# Altium schematic sheet GD_Power_Meter_3.SchDoc: Meter_2
size A3
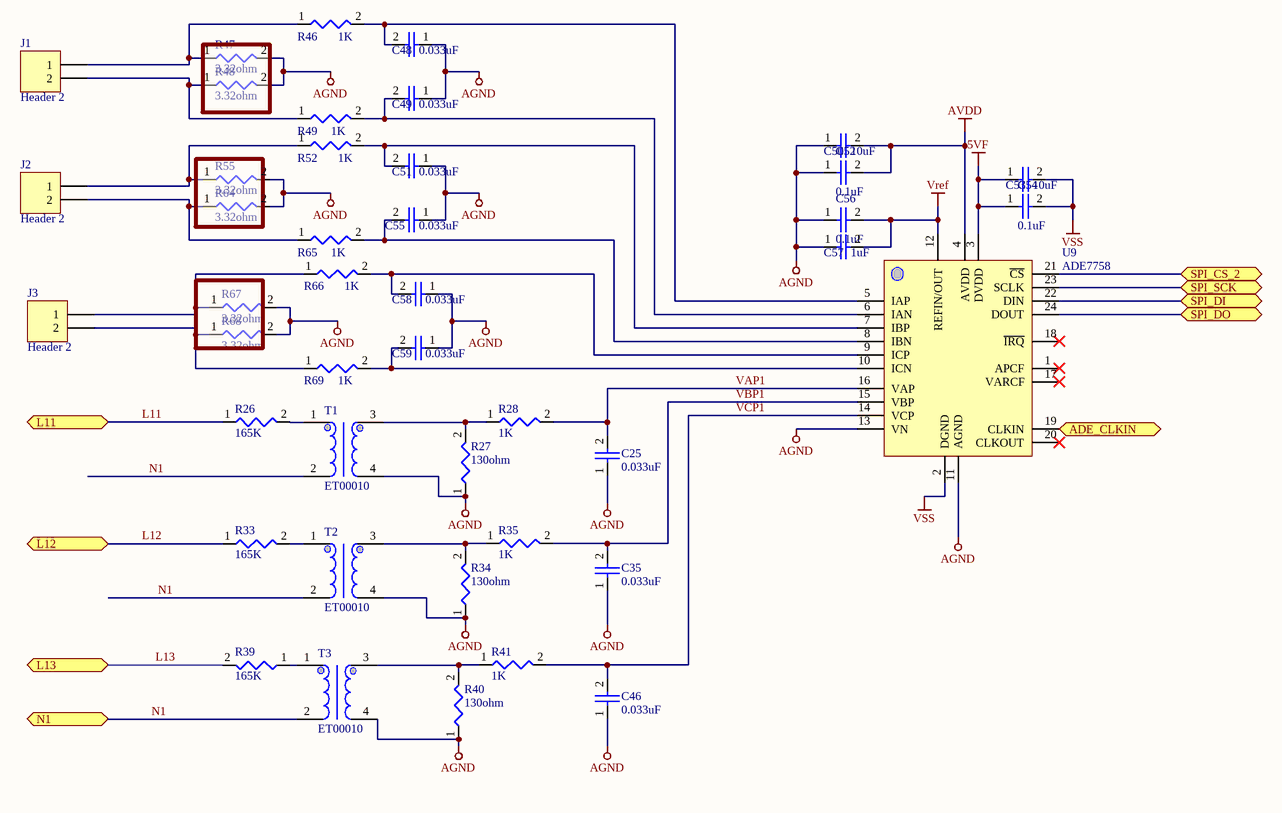
[diagram p0: GD_Power_Meter_3.SchDoc]

## Parts
C25  value 0.033uF  [C0805]  (hidden comment: CAP)
C35  value 0.033uF  [C0805]  (hidden comment: CAP)
C46  value 0.033uF  [C0805]  (hidden comment: CAP)
C48  value 0.033uF  [C0805]  (hidden comment: CAP)
C49  value 0.033uF  [C0805]  (hidden comment: CAP)
C50  10uF  [C0805]
C51  value 0.033uF  [C0805]  (hidden comment: CAP)
C52  value 0.1uF  [C0805]  (hidden comment: CAP)
C53  10uF  [C0805]
C54  value 0.1uF  [C0805]  (hidden comment: CAP)
C55  value 0.033uF  [C0805]  (hidden comment: CAP)
C56  value 0.1uF  [C0805]  (hidden comment: CAP)
C57  value 1uF  [C0805]  (hidden comment: CAP)
C58  value 0.033uF  [C0805]  (hidden comment: CAP)
C59  value 0.033uF  [C0805]  (hidden comment: CAP)
J1  Header 2  [533980271_sd]
J2  Header 2  [533980271_sd]
J3  Header 2  [533980271_sd]
R26  value 165K  [MFR5W2P5]  (hidden comment: RES)
R27  value 130ohm  [R0805]  (hidden comment: RES)
R28  value 1K  [R0805]  (hidden comment: RES)
R33  value 165K  [MFR5W2P5]  (hidden comment: RES)
R34  value 130ohm  [R0805]  (hidden comment: RES)
R35  value 1K  [R0805]  (hidden comment: RES)
R39  value 165K  [MFR5W2P5]  (hidden comment: RES)
R40  value 130ohm  [R0805]  (hidden comment: RES)
R41  value 1K  [R0805]  (hidden comment: RES)
R46  value 1K  [R0805]  (hidden comment: RES)
R47  value 3.32ohm  [R0805]  (hidden comment: RES)
R48  value 3.32ohm  [R0805]  (hidden comment: RES)
R49  value 1K  [R0805]  (hidden comment: RES)
R52  value 1K  [R0805]  (hidden comment: RES)
R55  value 3.32ohm  [R0805]  (hidden comment: RES)
R64  value 3.32ohm  [R0805]  (hidden comment: RES)
R65  value 1K  [R0805]  (hidden comment: RES)
R66  value 1K  [R0805]  (hidden comment: RES)
R67  value 3.32ohm  [R0805]  (hidden comment: RES)
R68  value 3.32ohm  [R0805]  (hidden comment: RES)
R69  value 1K  [R0805]  (hidden comment: RES)
T1  ET00010  [ZMPT107]
T2  ET00010  [ZMPT107]
T3  ET00010  [ZMPT107]
U9  ADE7758  [SOIC24-W]

## Ports
ADE_CLKIN (bidir), L11, L12, L13, N1, SPI_CS_2, SPI_DI, SPI_DO (bidir), SPI_SCK

## Nets
5VF: C53.1 C54.1 U9.3(DVDD)
AGND: C25.1 C35.1 C46.1 C48.1 C49.1 C50.1 C51.1 C52.1 C55.1 C56.1 C57.1 C58.1 C59.1 R27.1 R34.1 R40.1 R47.2 R48.2 R55.2 R64.2 R67.2 R68.2 T1.4 T2.4 T3.4 U9.11(AGND) U9.13(VN)
AVDD: C50.2 C52.2 U9.4(AVDD)
Vref: C56.2 C57.2 U9.12(REFIN/OUT)
VSS: C53.2 C54.2 U9.2(DGND)
ADE_CLKIN: U9.19(CLKIN) ; port ADE_CLKIN
L11: R26.1 ; port L11
L12: R33.1 ; port L12
L13: R39.2 ; port L13
N1: T1.2 T2.2 T3.2 ; port N1
SPI_CS_2: U9.21(~{CS}) ; port SPI_CS_2
SPI_DI: U9.22(DIN) ; port SPI_DI
SPI_DO: U9.24(DOUT) ; port SPI_DO
SPI_SCK: U9.23(SCLK) ; port SPI_SCK
VAP1: C25.2 R28.2 U9.16(VAP)
VBP1: C35.2 R35.2 U9.15(VBP)
VCP1: C46.2 R41.2 U9.14(VCP)
NetC48_2: C48.2 R46.2 U9.5(IAP)
NetC49_2: C49.2 R49.2 U9.6(IAN)
NetC51_2: C51.2 R52.2 U9.7(IBP)
NetC55_2: C55.2 R65.2 U9.8(IBN)
NetC58_2: C58.2 R66.2 U9.9(ICP)
NetC59_2: C59.2 R69.2 U9.10(ICN)
NetJ1_1: J1.1 R46.1 R47.1
NetJ1_2: J1.2 R48.1 R49.1
NetJ2_1: J2.1 R52.1 R55.1
NetJ2_2: J2.2 R64.1 R65.1
NetJ3_1: J3.1 R66.1 R67.1
NetJ3_2: J3.2 R68.1 R69.1
NetR26_2: R26.2 T1.1
NetR27_2: R27.2 R28.1 T1.3
NetR33_2: R33.2 T2.1
NetR34_2: R34.2 R35.1 T2.3
NetR39_1: R39.1 T3.1
NetR40_2: R40.2 R41.1 T3.3

Not connected (* = marked no-connect by the designer): U9 1(APCF)* 17(VARCF)* 18(~{IRQ})* 20(CLKOUT)*

## Library data of the parts
C25 C35 C46 C48 C49 C51 C55 C58 C59 = EC00079: CAP SMD X7R 50V 10% 0.033uF 0805 ROHS; Manufacturer: Murata; Manufacturer P/N: GRM219R71H333KA01; ID: 79; HelpURL: \\192.168.1.3\Esh\Department\RD\CAD\Component\Capacitor\smd\Murata_mpdf.pdf; P/N: EC00079
C50 C53 = EC00034: CAP SMD CR X5R 16V 10% 10uF 0805 ROHS; Manufacturer: Murata; Manufacturer P/N: GRM21BR61C106KE15; Value: 10uF_16V; ID: 34; Type: ****; HelpURL: *; P/N: EC00034
C52 C54 C56 = EC00014: CAP SMD CR X7R 50V 10% 0.1uF 0805 ROHS; Manufacturer: YAGEO; Manufacturer P/N: CC0805KRX7R9BB104; ID: 14; HelpURL: *; P/N: EC00014
C57 = EC00002: CAP SMD CR X7R 50V 10% 1uF 0805 ROHS; Manufacturer: YAGEO; Manufacturer P/N: CC0805KKX7R9BB105; ID: 2; HelpURL: *; P/N: EC00002
J1-J3 = EJ00039: CONNECTOR 1.25mm Pitch Header, Surface Mount, Vertical, Lead-Free, 2 Circuits; Manufacturer: MOLEX; ID: 39; Value: 533980271; HelpURL: \\192.168.1.3\Esh\Department\RD\CAD\Component\connector\molex\533980271_sd.pdf; P/N: EJ00039; Manufacturer P/N: 533980271
R26 R33 R39 = ER00275: RES Film Leaded 165K 0.5% 3W ROHS ±25ppm/℃ MFR1550; Manufacturer: Viking; Manufacturer P/N: MFR1550DACR1653; ID: 275; HelpURL: *; P/N: ER00275
R27 R34 R40 = ER00280: RES,THIN_FILM,130 ohm,0.5%	,1/10W,±25ppm/℃,ROHS,0805,SMD; Manufacturer: VIKING; Manufacturer P/N: AR05DTC1300; ID: 280; HelpURL: *; P/N: ER00280
R28 R35 R41 R46 R49 R52 R65 R66 R69 = ER00028: RES THICK_FILM SMD 1K 1% 1/8W ROHS 0805; Manufacturer: YAGEO; Manufacturer P/N: RC0805FR-071KL; ID: 28; P/N: ER00028
  R28 R35 R41: HelpURL: \\192.168.1.3\Esh\Department\RD\CAD\Component\Resistor\RC0805-257173.pdf
  R46 R49 R52 R65 R66 R69: HelpURL: *
R47 R48 R55 R64 R67 R68 = ER00273: RES THIN_FILM SMD 3.32 ohm 0.5% 1/8W ±50ppm/℃ ROHS 0805; Manufacturer: YAGEO; Manufacturer P/N: RT0805DRE073R32; ID: 273; HelpURL: *; P/N: ER00273
T1-T3 = ET00010: Voltage transformer,2mA/2mA,THT,ROHS; Manufacturer: ZEMING; Value: ZMPT107; ID: 10; HelpURL: *; P/N: ET00010; Manufacturer P/N: ZMPT107
U9 = EU00042: IC Energy Measurement,Irms,VA,VAR,Vrms,Watt,Output:Pulsed&SPI,SOIC_W-24,ROHS; Manufacturer P/N: ADE7758ARWZRL; Manufacturer: ANALOG DEVICES; ID: 42; Value: ADE7758ARWZRL; HelpURL: \\192.168.1.3\Esh\Department\RD\CAD\Component\Energy Measurement\ADE7758.pdf; P/N: EU00042; Type: *****